# EasyEDA schematic SCH_Orion Power Supply_2023-01-06.json
TITLE: Schematic Orion Power Supply 12VCC/2A; REV: 1.0; Date: 2023-01-06; Sheet: 1/1; Drawn By: MarcosObel; Company: Zutup All Electronic
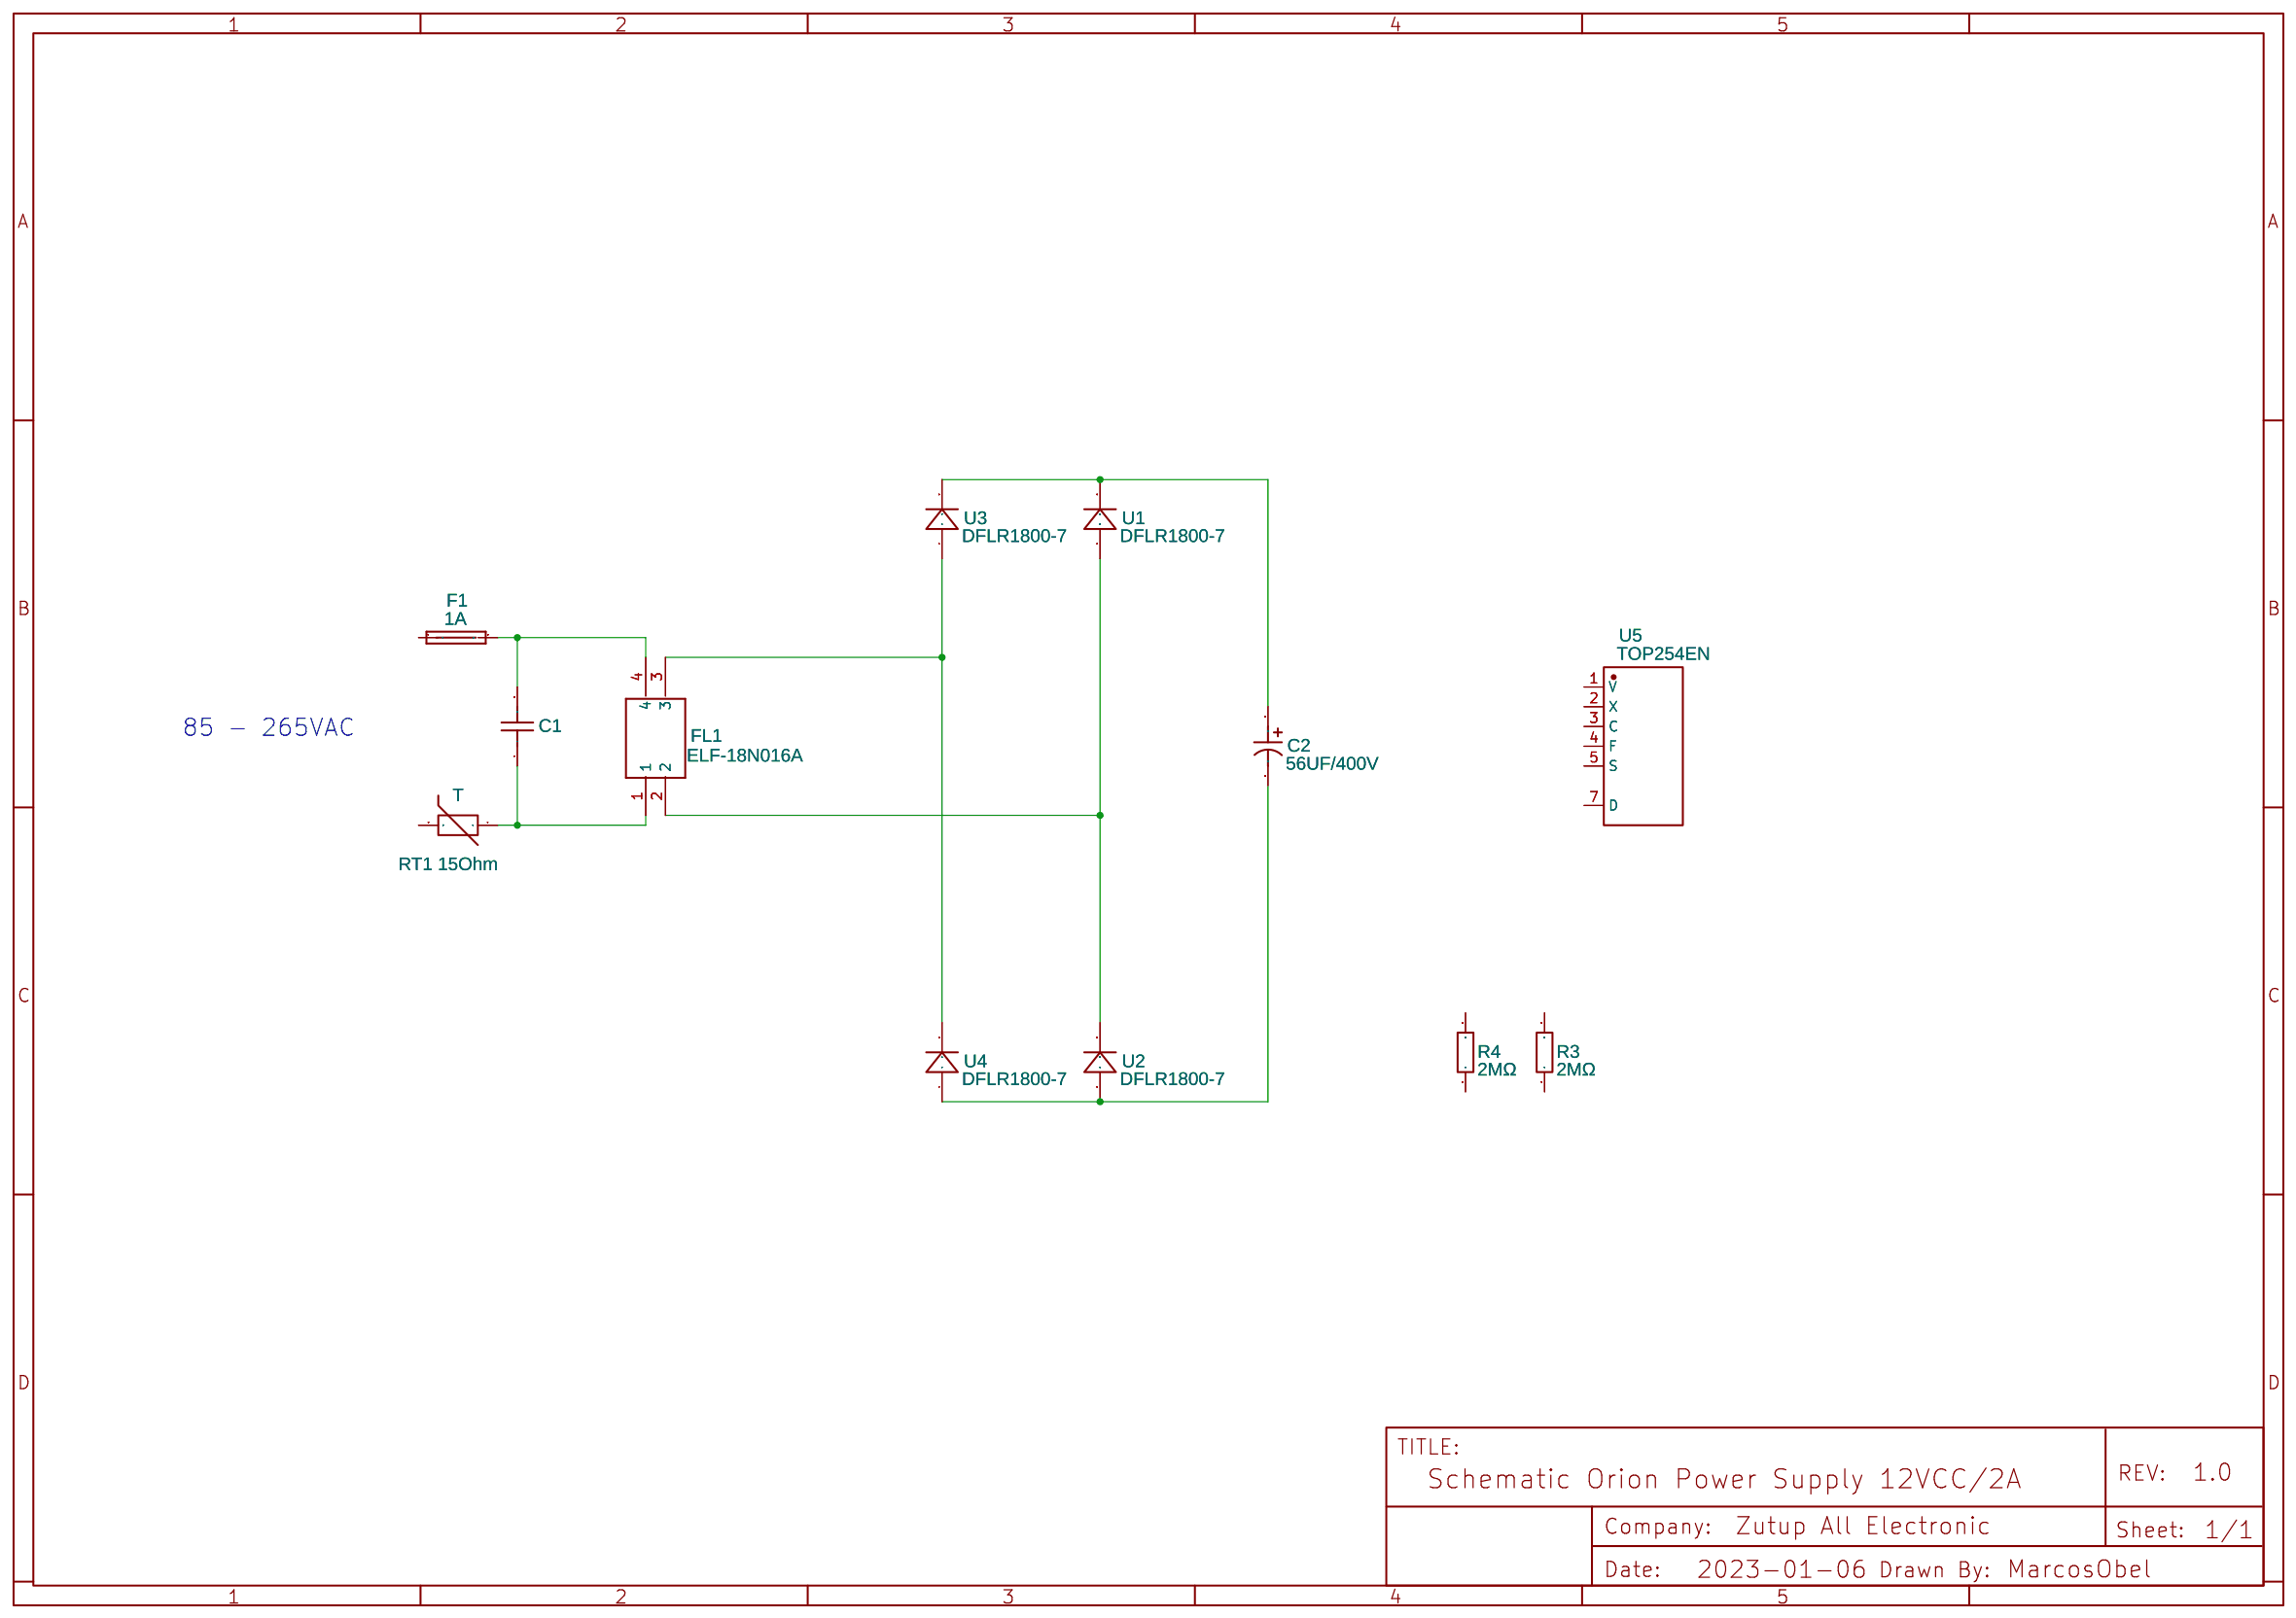
[diagram p0: schematic sheet]

## Parts
C1  C212G473K3AC000  [CAP-TH_L9.8-W5.0-P7.50-D1.0]
C2  56UF/400V  [CAP-TH_BD12.8-P5.00-D0.6-FD]
F1  1A  [FUSE-HOLDER-WITH-COVER-FOR-5X20MM-FUSE_FOOTPRINT]
FL1  ELF-18N016A  [ELF18N016A]
R3  2MΩ  [CAP-TH_L15.1-W5.0-P12.70-D1.2]
R4  2MΩ  [CAP-TH_L15.1-W5.0-P12.70-D1.2]
T  RT1 15Ohm  [TERMISTOR]
U1  DFLR1800-7  [DFLR1800-7]
U2  DFLR1800-7  [DFLR1800-7]
U3  DFLR1800-7  [DFLR1800-7]
U4  DFLR1800-7  [DFLR1800-7]
U5  TOP254EN  [ESIP-7C__L10.2-W2.0-P2.54-LS3.0-TL]

## Library data of the parts
C1 = C212G473K3AC000: Supplier: LCSC; Supplier Part: C3025105; Manufacturer: faratronic(厦门法拉); link: https://atta.szlcsc.com/upload/public/pdf/source/20210701/C2840807_F527A4AE17BBF4EE9067F9ABB44EC845.pdf; Contributor: lcsc; Capacitance: 47nF
C2 = 47UF/400V: Supplier: LCSC; Supplier Part: C9900023263; Manufacturer: null; Manufacturer Part: 47uF/400V; JLCPCB Part Class: Extended Part; Contributor: lcsc
F1 = FUSE HOLDER PANJANG: Contributor: icet-t1
FL1 = ELF-18N016A: Contributor: Praudyogi_EE
R3 R4 = MHR0314SA207F70: Supplier: LCSC; Supplier Part: C116786; Manufacturer: muRata(村田); Resistance (Ohms): 200M; Contributor: LCSC; JLCPCB Part Class: Extended Part
T = TERMISTOR: Contributor: dentflexbrasil
U1-U4 = DFLR1800-7: Manufacturer: Diodes Incorporated; link: https://kr.mouser.com/datasheet/2/115/DFLR1800-10520.pdf; Contributor: nscw2011
U5 = TOP254EN: Supplier: LCSC; Supplier Part: C568146; Manufacturer: Power Integrations(帕沃英蒂格盛); link: https://atta.szlcsc.comnull; Contributor: lcsc

## Nets
Net-(C1-1): C1.1 FL1.1 T.1
Net-(C1-2): C1.2 F1.2 FL1.4
Net-(C2-1): C2.1 U1.2 U3.2
Net-(C2-2): C2.2 U2.1 U4.1
Net-(FL1-2): FL1.2 U1.1 U2.2
Net-(FL1-3): FL1.3 U3.1 U4.2

Not connected (* = marked no-connect by the designer): F1 1; R3 1 2; R4 1 2; T 2; U5 1(V) 2(X) 3(C) 4(F) 5(S) 7(D)

## Notes on the sheet
- 85 - 265VAC
